# EAGLE design DOGS102 (EAGLE 5.10)
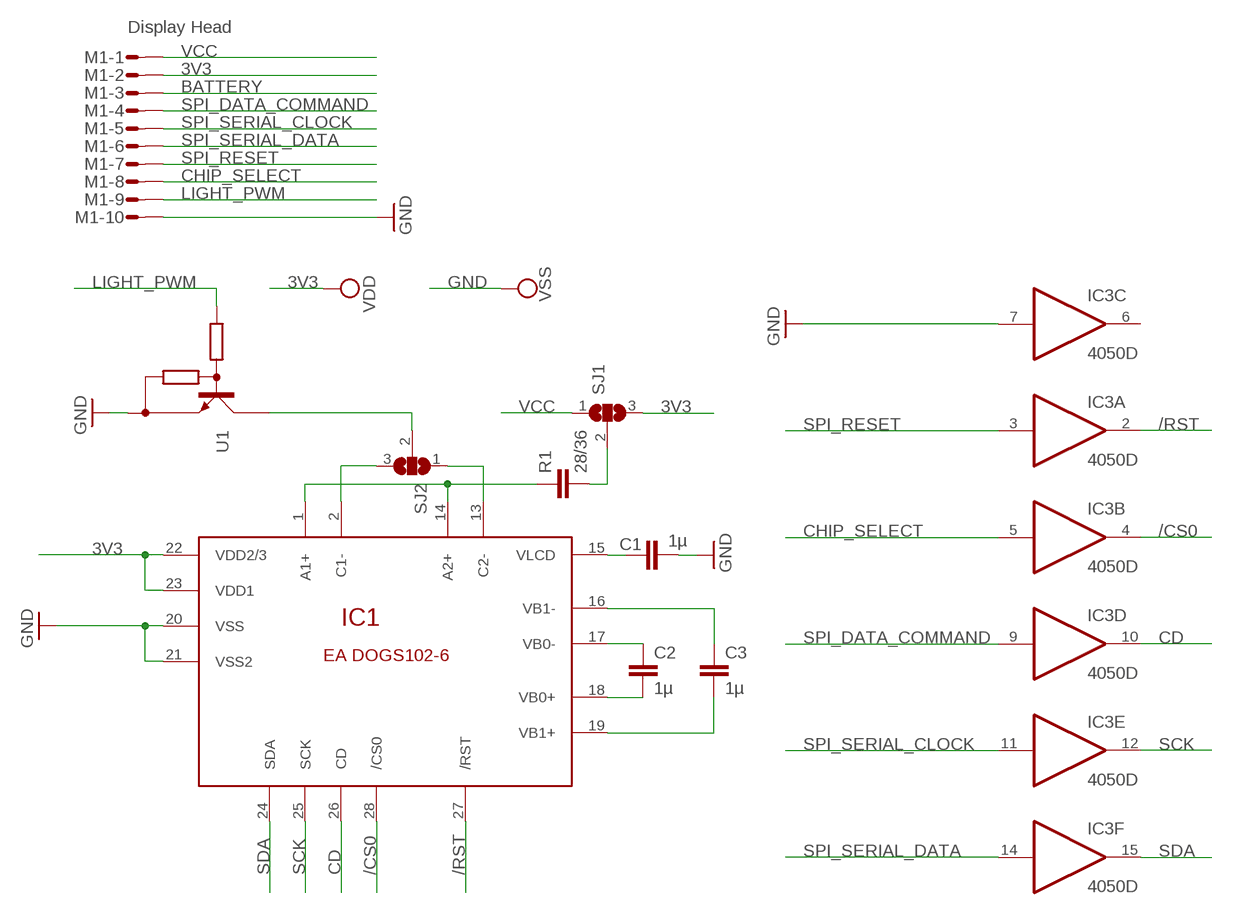
[diagram p0: schematic, sheet 1]

## Parts
C1  1µ  C-EUC0805  [C0805]
C2  1µ  C-EUC0805  [C0805]
C3  1µ  C-EUC0805  [C0805]
IC1  EADOGS102  [EADOGS102]
IC3  4050D  [SO16]
M1  Display Head  MICROMATCH-10  [MICROMATCH-10]
R1  28/36  C-EUC0805  [C0805]
SJ1  SJ2W  [SJ_2]
SJ2  SJ2W  [SJ_2]
U1  Light  BCR135  [SOT23R_INFINEON]

## Nets
3V3: IC1.22(VDD2/3) IC1.23(VDD1) M1.2 SJ1.3 ; supply symbol labelled VDD
/CS0: IC1.28(/CS0) IC3.4(B:O)
/RST: IC1.27(/RST) IC3.2(A:O)
BATTERY: M1.3
CD: IC1.26(CD) IC3.10(D:O)
CHIP_SELECT: IC3.5(B:I) M1.8
GND: C1.2 IC1.20(VSS) IC1.21(VSS2) IC3.7(C:I) M1.10 U1.2(E) ; supply symbol labelled VSS
LIGHT_PWM: M1.9 U1.1(B)
N$1: C2.1 IC1.17(VB0-)
N$2: C2.2 IC1.18(VB0+)
N$3: C3.2 IC1.19(VB1+)
N$4: C3.1 IC1.16(VB1-)
N$5: C1.1 IC1.15(VLCD)
N$6: IC1.1(A1+) IC1.14(A2+) R1.1
N$7: R1.2 SJ1.2
N$8: IC1.2(C1-) SJ2.3
N$13: IC1.13(C2-) SJ2.1
N$14: SJ2.2 U1.3(C)
SCK: IC1.25(SCK) IC3.12(E:O)
SDA: IC1.24(SDA) IC3.15(F:O)
SPI_DATA_COMMAND: IC3.9(D:I) M1.4
SPI_RESET: IC3.3(A:I) M1.7
SPI_SERIAL_CLOCK: IC3.11(E:I) M1.5
SPI_SERIAL_DATA: IC3.14(F:I) M1.6
VCC: M1.1 SJ1.1
Unconnected: IC3.6(C:O)

## Power pins joined to a net without a drawn wire
3V3: IC3.1(P:VDD)
GND: IC3.8(P:VSS)

## Library data of the parts
C1-C3 R1 = resistor:C-EU: CAPACITOR, European symbol
IC1 = ea-dogs102:EADOGS102
IC3 = 40xx:4050: Hex non-inverting BUFFER
M1 = con-amp-micromatch:MICROMATCH-10: MicroMaTch 10 8-215464-0 / 1-215464-0 Drawing Number C-215464 DDEController.pdf
SJ1 SJ2 = jumper:SJ2W: SMD solder JUMPER
U1 = pst-transistor-small-signal:BCR135: NPN Silicon Digital Transistor

## Board
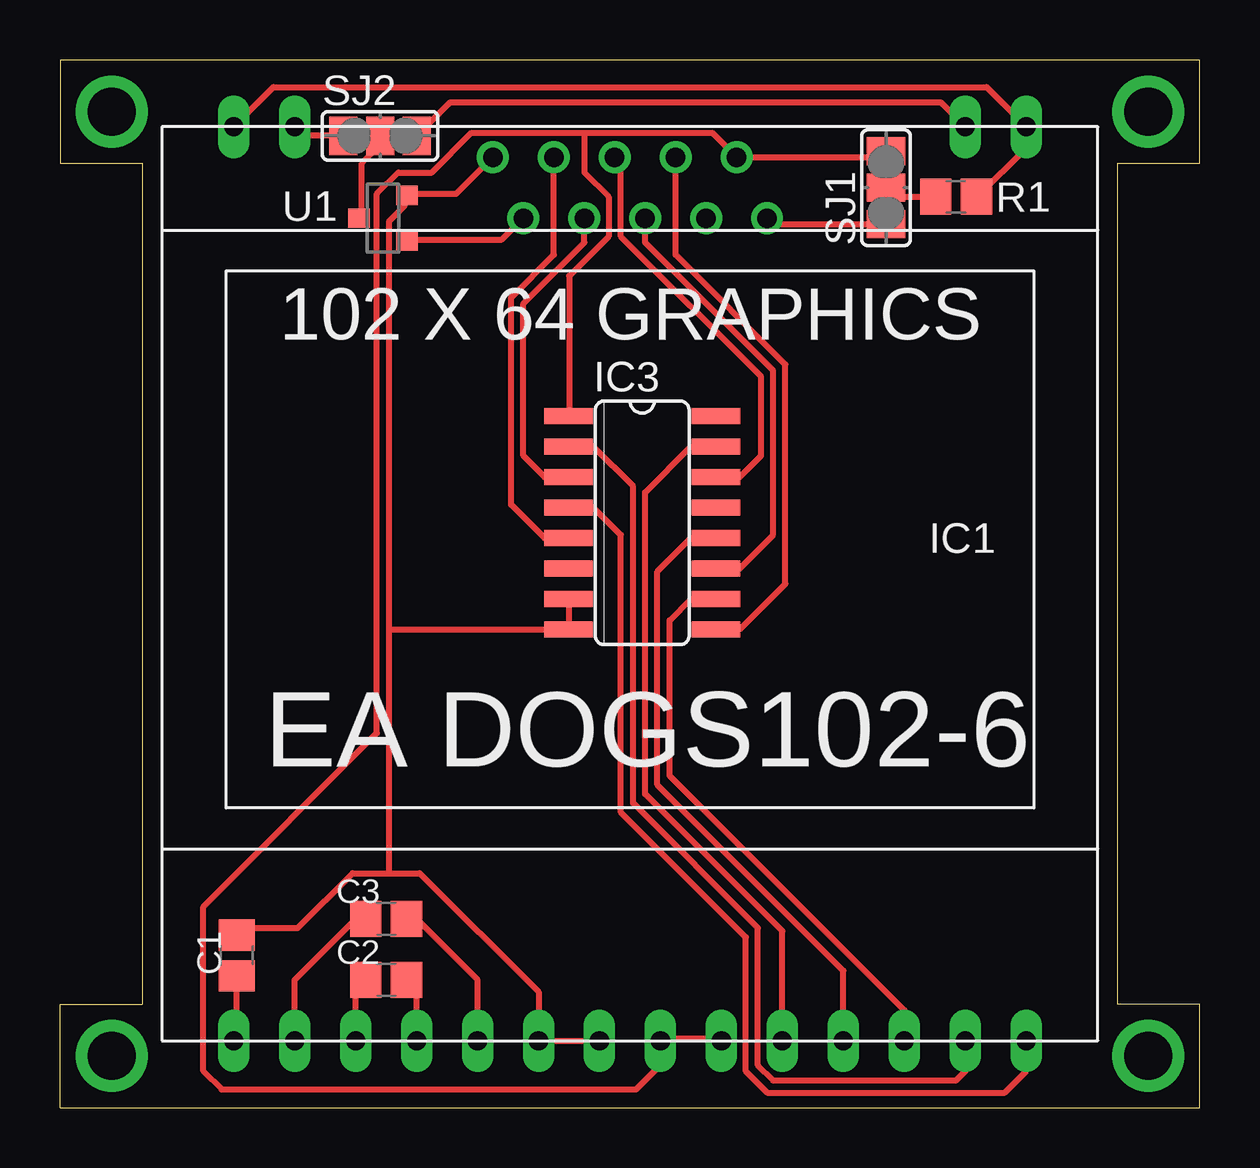
[diagram p1: board, top side]
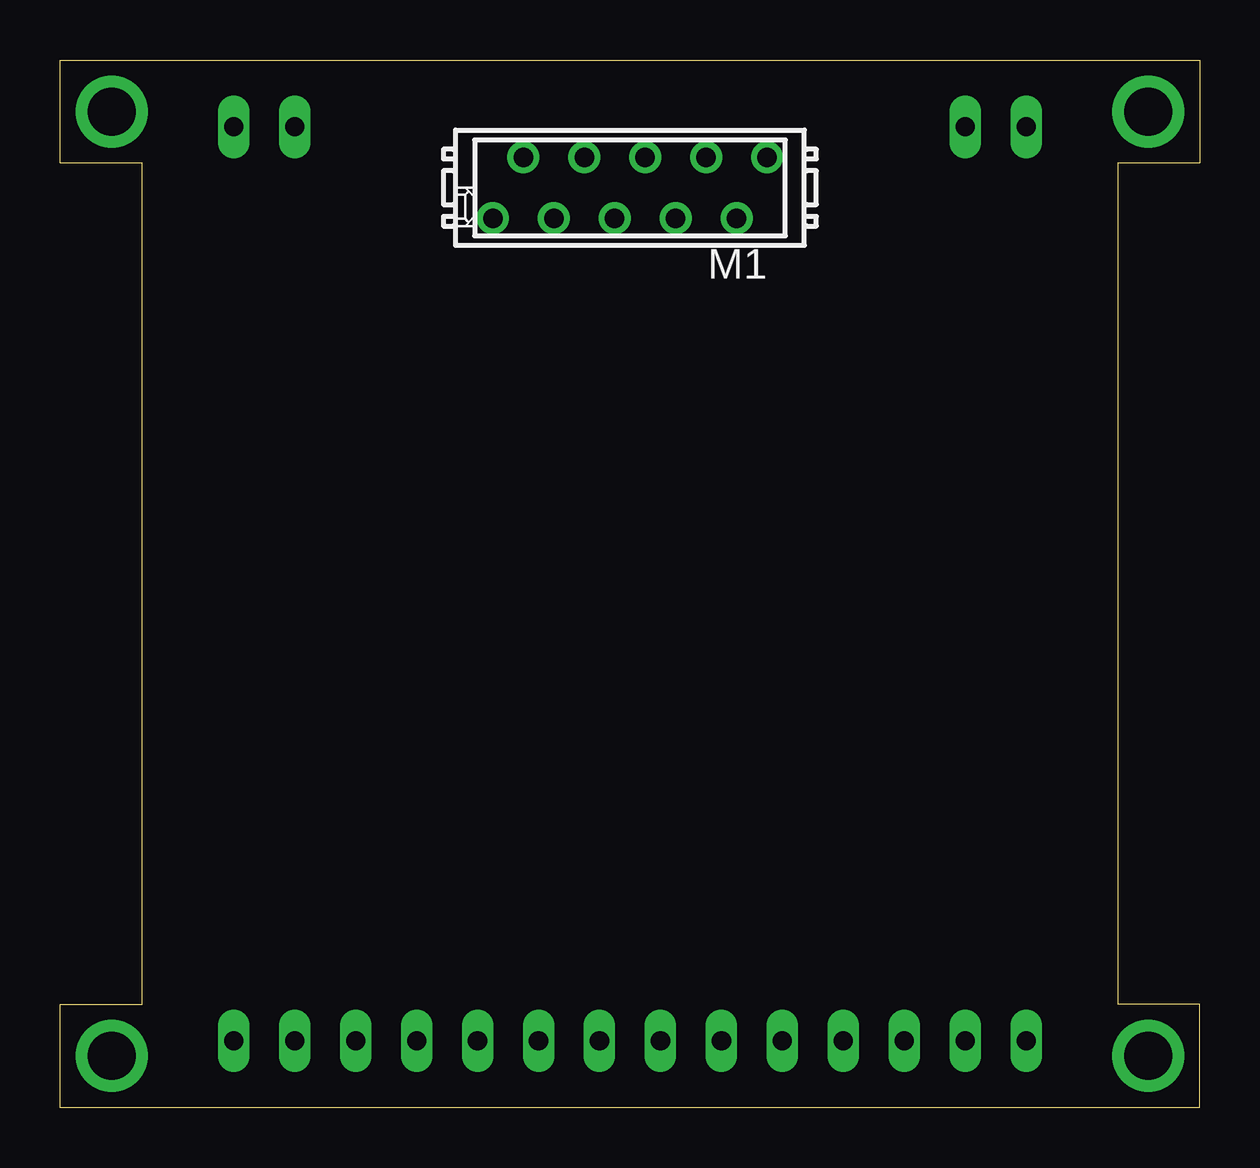
[diagram p2: board, bottom side, seen from below]

Size 47.5 x 43.68 mm. Coordinates in mm from the lower left corner, seen from the top.
Outline: 47.5,0 47.5,4.32 44.07,4.32 44.07,39.37 47.5,39.37 47.5,43.68 0,43.68 0,39.37 3.43,39.37 3.43,4.32 0,4.32 0,0 47.5,0
Copper layers (1*16): Top 0.035mm / dielectric 1.5mm / Bottom 0.035mm
Design rules "6mil": minimum track width 10mil, minimum drill 24mil, track to track 6mil, track to pad 6mil, pad to pad 6mil, via to via 6mil, smd to smd 6mil, copper to edge 20mil, drill to drill 6mil, minimum pad ring 10mil, minimum via ring 8mil, stop-mask expansion 4mil, vias tented up to drill 0mil, thermal gap 10mil

### Footprints (pad centres in the part's own frame; a part is rotated, then mirrored left to right if it is on the bottom)
C0805 = smd 1.3 x 1.5: 1 -0.85,0; 2 0.85,0
EADOGS102 = drill 0.8 long: 1 -16.51,-19.05; 2 -13.97,-19.05; 13 13.97,-19.05; 14 16.51,-19.05; 15 16.51,19.05; 16 13.97,19.05; 17 11.43,19.05; 18 8.89,19.05; 19 6.35,19.05; 20 3.81,19.05; 21 1.27,19.05; 22 -1.27,19.05; 23 -3.81,19.05; 24 -6.35,19.05; 25 -8.89,19.05; 26 -11.43,19.05; 27 -13.97,19.05; 28 -16.51,19.05
SO16 = smd 0.66 x 2.032: 1 -4.445,-3.073; 2 -3.175,-3.073; 3 -1.905,-3.073; 4 -0.635,-3.073; 5 0.635,-3.073; 6 1.905,-3.073; 7 3.175,-3.073; 8 4.445,-3.073; 9 4.445,3.073; 10 3.175,3.073; 11 1.905,3.073; 12 0.635,3.073; 13 -0.635,3.073; 14 -1.905,3.073; 15 -3.175,3.073; 16 -4.445,3.073
MICROMATCH-10 = drill 0.813 round: 1 5.715,1.27; 2 4.445,-1.27; 3 3.175,1.27; 4 1.905,-1.27; 5 0.635,1.27; 6 -0.635,-1.27; 7 -1.905,1.27; 8 -3.175,-1.27; 9 -4.445,1.27; 10 -5.715,-1.27
SJ_2 = smd 1.168 x 1.6: 1 -1.524,0; 2 0,0; 3 1.524,0
SOT23R_INFINEON = smd 0.8 x 0.9: 1 -0.95,-1; 2 0.95,-1; 3 0,1

### Placement (x,y rotation side)
C1  7.37,6.35 90 top
C2  13.59,5.33 0 top
C3  13.59,7.87 0 top
IC1  23.75,21.84 180 top
IC3  24.26,24.38 270 top
M1  23.75,38.35 180 bottom
R1  37.34,37.97 180 top
SJ1  34.42,38.35 90 top
SJ2  13.33,40.51 0 top
U1  13.46,37.08 90 top

### Tracks (layer width: path | path; a pad name or v marks a point on that pad's centre or on a via)
3V3
  Top 0.254: SJ1.3 34.16,39.62 M1.2 27.18,40.64 21.84,40.64 | 21.84,40.64 21.84,38.99 22.86,37.97 22.86,36.32 21.21,34.67 21.21,28.83 IC3.1 | 21.84,40.64 17.14,40.64 15.49,38.99 14.1,38.99 13.21,38.1 13.21,15.62 5.97,8.38 5.97,1.52 6.73,0.76 24,0.76 25.02,1.78 IC1.22 25.02,2.9 27.46,2.9 IC1.23
/CS0
  Top 0.254: IC1.28 40.26,1.52 39.37,0.64 29.46,0.64 28.58,1.52 28.58,7.11 23.37,12.32 23.37,23.88 22.23,25.02 IC3.4
/RST
  Top 0.254: IC1.27 37.72,1.52 37.34,1.14 29.72,1.14 29.08,1.78 29.08,7.49 23.88,12.7 23.88,25.91 22.23,27.56 IC3.2
CD
  Top 0.254: IC1.26 35.18,4.06 25.4,13.84 25.4,20.32 26.29,21.21 IC3.10
CHIP_SELECT
  Top 0.254: M1.8 20.57,35.56 18.8,33.78 18.8,25.15 20.19,23.75 IC3.5
GND
  Top 0.254: IC1.21 IC1.20 19.94,4.83 14.99,9.78 13.72,9.78 | M1.10 16.51,38.1 14.48,38.1 U1.2 14.35,37.97 14.35,37.59 13.72,36.96 13.72,19.94 | C1.2 7.37,7.49 9.91,7.49 12.19,9.78 13.72,9.78 | 13.72,19.94 IC3.8 21.21,19.96 21.21,21.18 IC3.7 | 13.72,9.78 13.72,19.94
LIGHT_PWM
  Top 0.254: M1.9 18.42,36.2 14.48,36.2 U1.1
N$1
  Top 0.254: IC1.17 12.32,4.95 12.7,5.33 C2.1
N$2
  Top 0.254: IC1.18 14.86,4.95 C2.2
N$3
  Top 0.254: C3.2 14.86,7.87 17.4,5.33 IC1.19
N$4
  Top 0.254: C3.1 12.32,7.87 9.78,5.33 IC1.16
N$5
  Top 0.254: IC1.15 7.37,2.92 C1.1
N$6
  Top 0.254: IC1.14 8.89,42.55 38.61,42.55 IC1.1 40.26,40.01 38.23,37.97 R1.1
N$7
  Top 0.254: SJ1.2 34.8,37.97 R1.2
N$8
  Top 0.254: IC1.2 36.7,41.91 16.26,41.91 SJ2.3
N$9  (via drill 2 pad 3)
  other vias: 2.16,2.16
N$10  (via drill 2 pad 3)
  other vias: 2.16,41.53
N$11  (via drill 2 pad 3)
  other vias: 45.34,41.53
N$12  (via drill 2 pad 3)
  other vias: 45.34,2.16
N$13
  Top 0.254: SJ2.1 10.16,40.51 IC1.13
N$14
  Top 0.254: SJ2.2 13.33,40.13 12.57,39.37 12.57,37.08 U1.3
SCK
  Top 0.254: IC1.25 32.64,5.71 24.89,13.46 24.89,22.35 26.29,23.75 IC3.12
SDA
  Top 0.254: IC1.24 30.1,7.37 24.38,13.08 24.38,25.65 26.29,27.56 IC3.15
SPI_DATA_COMMAND
  Top 0.254: M1.4 25.65,35.56 30.23,30.99 30.23,21.84 28.32,19.94 IC3.9
SPI_RESET
  Top 0.254: M1.7 21.84,36.07 19.3,33.53 19.3,27.18 20.19,26.29 IC3.3
SPI_SERIAL_CLOCK
  Top 0.254: 26.8,22.48 IC3.11 28.32,22.48 29.72,23.88 29.72,30.73 24.38,36.07 M1.5
SPI_SERIAL_DATA
  Top 0.254: M1.6 23.37,39.37 23.37,36.32 29.21,30.48 29.21,27.18 28.32,26.29 IC3.14
VCC
  Top 0.254: M1.1 29.72,36.83 SJ1.1